# EAGLE schematic lvc (EAGLE 7.6.0)
DOC_NUM: 1; REVISION: A
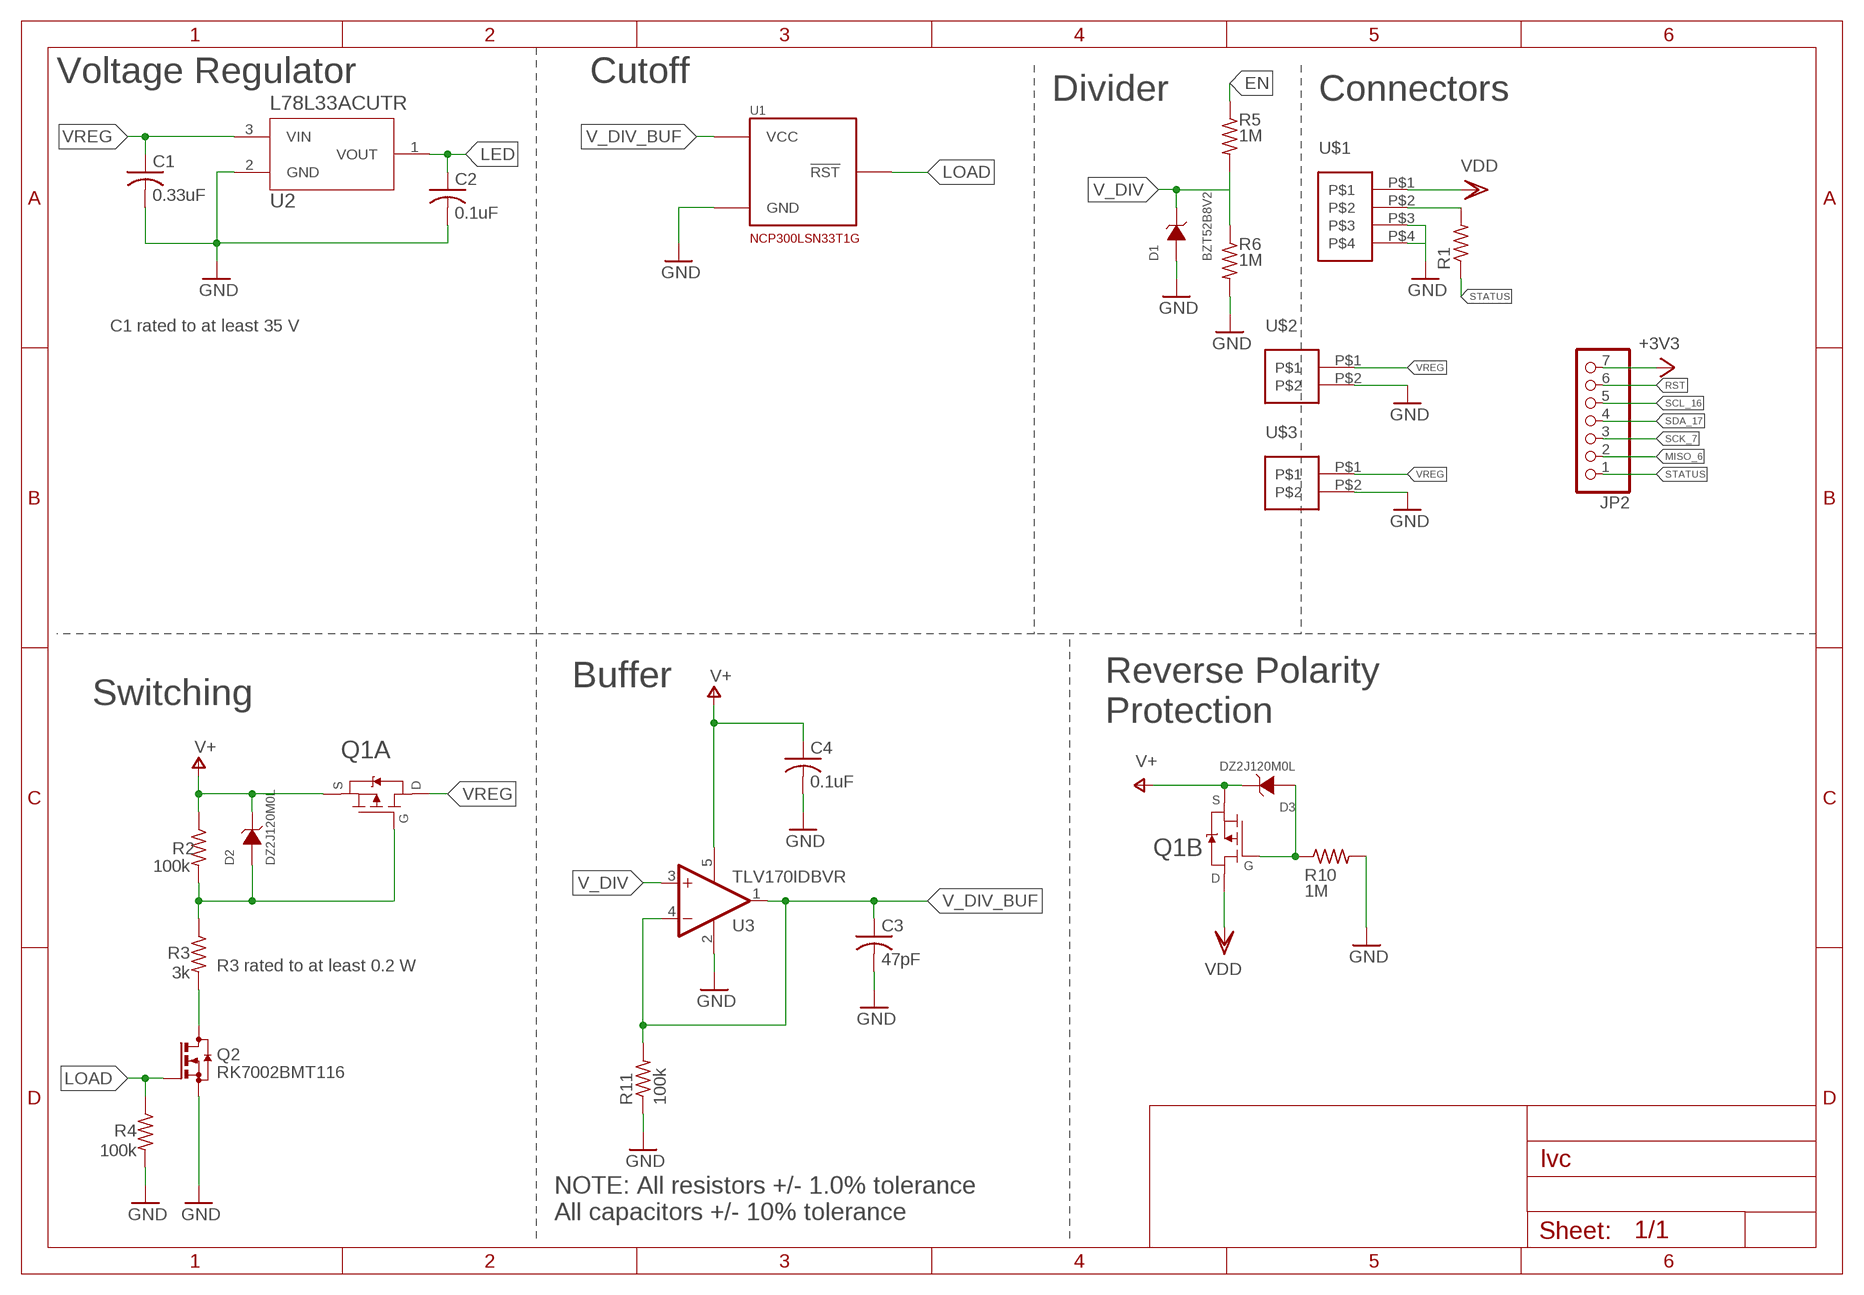
[diagram p0: schematic, sheet 1]

## Parts
C1  0.33uF  C-USC0603  [C0603]
C2  0.1uF  C-USC0603  [C0603]
C3  47pF  C-USC0603  [C0603]
C4  0.1uF  C-USC0603  [C0603]
D1  BZT52B8V2  [SOD123]
D2  DZ2J120M0L  [SMINI2-F5-B]
D3  DZ2J120M0L  [SMINI2-F5-B]
JP2  PINHD-1X7  [1X07]
Q1  SI7997DP  [POWERPAK-SO-8-DUAL]
Q2  RK7002BMT116  [SOT23]
R1  R-US_R0603  [R0603]
R2  100k  R-US_R0603  [R0603]
R3  3k  R-US_R0603  [R0603]
R4  100k  R-US_R0603  [R0603]
R5  1M  R-US_R0603  [R0603]
R6  1M  R-US_R0603  [R0603]
R10  1M  R-US_R0603  [R0603]
R11  100k  R-US_R0603  [R0603]
U1  NCP300LSN33T1G  [SOT23-5]
U2  L78L33ACUTR  [SOT-89]
U3  TLV170IDBVR  [SOT23-DBV]
U$1  MICROCLASP_4  [4_PIN_MICROCLASP]
U$2  LITEAPRS  [LITEAPRS]
U$3  LITEAPRS  [LITEAPRS]

## Nets
EN: R5.1
GND: C1.2 C2.2 C3.2 C4.2 D1.A Q2.2(S) R4.2 R6.2 R10.2 R11.1 U1.3(GND) U2.2(GND) U3.2(V-) U$1.P$3 U$1.P$4 U$2.P$2 U$3.P$2
LED: C2.1 U2.1(VOUT)
LOAD: Q2.1(G) R4.1 U1.1(!RST!)
MISO_6: JP2.2
N$1: R1.2 U$1.P$2
N$5: D2.A Q1.4(A:G) R2.2 R3.1
N$6: D3.A Q1.2(B:G) R10.1
N$7: Q2.3(D) R3.2
N$9: JP2.7 ; supply symbol labelled +3V3
RST: JP2.6
SCK_7: JP2.3
SCL_16: JP2.5
SDA_17: JP2.4
STATUS: JP2.1 R1.1
V+: C4.1 D2.C D3.C Q1.1(B:S) Q1.3(A:S) R2.1 U3.5(V+)
V_DIV: D1.C R5.2 R6.1 U3.3(+IN)
V_DIV_BUF: C3.1 R11.2 U1.2(VCC) U3.1(OUT) U3.4(-IN)
VDD: Q1.7(B:D) Q1.8(B:D) Q1.8L(B:D) U$1.P$1
VREG: C1.1 Q1.5(A:D) Q1.5L(A:D) Q1.6(A:D) U2.3(VIN) U$2.P$1 U$3.P$1

## Notes on the sheet
- Voltage Regulator | Cutoff
- Divider | Connectors
- C1 rated to at least 35 V
- Buffer
- Switching
- Reverse Polarity
  Protection
- R3 rated to at least 0.2 W
- NOTE: All resistors +/- 1.0% tolerance
  All capacitors +/- 10% tolerance

## Library data of the parts
C1-C4 = rcl:C-US: CAPACITOR, American symbol; SPICEPREFIX: C
D1 = vishay1:BZT52B8V2
D2 D3 = LR_zener:DZ2J120M0L; MANUFACTURER_PART_NUMBER: DZ2J120M0L; VENDOR: Panasonic
JP2 = pinhead:PINHD-1X7: PIN HEADER
Q1 = AR_transistor:SI7997DP
Q2 = LR_transistor:RK7002BMT116
R1-R6 R10 = resistor:R-US_: RESISTOR, American symbol
R11 = rcl:R-US_: RESISTOR, American symbol; SPICEPREFIX: R
U1 = onsemi:NCP300LSN33T1G
U2 = LR_vreg:L78L33ACUTR; MANUFACTURER_PART_NUMBER: L78L33ACUTR; VENDOR: STMicroelectronics
U3 = LR_op_amps:TLV170IDBVR: TI TLV170IDBVR Op-amp
U$1 = NR_connectors:MICROCLASP_4
U$2 U$3 = NR_connectors:LITEAPRS